# EAGLE schematic QT2640 (EAGLE 9.5.2)
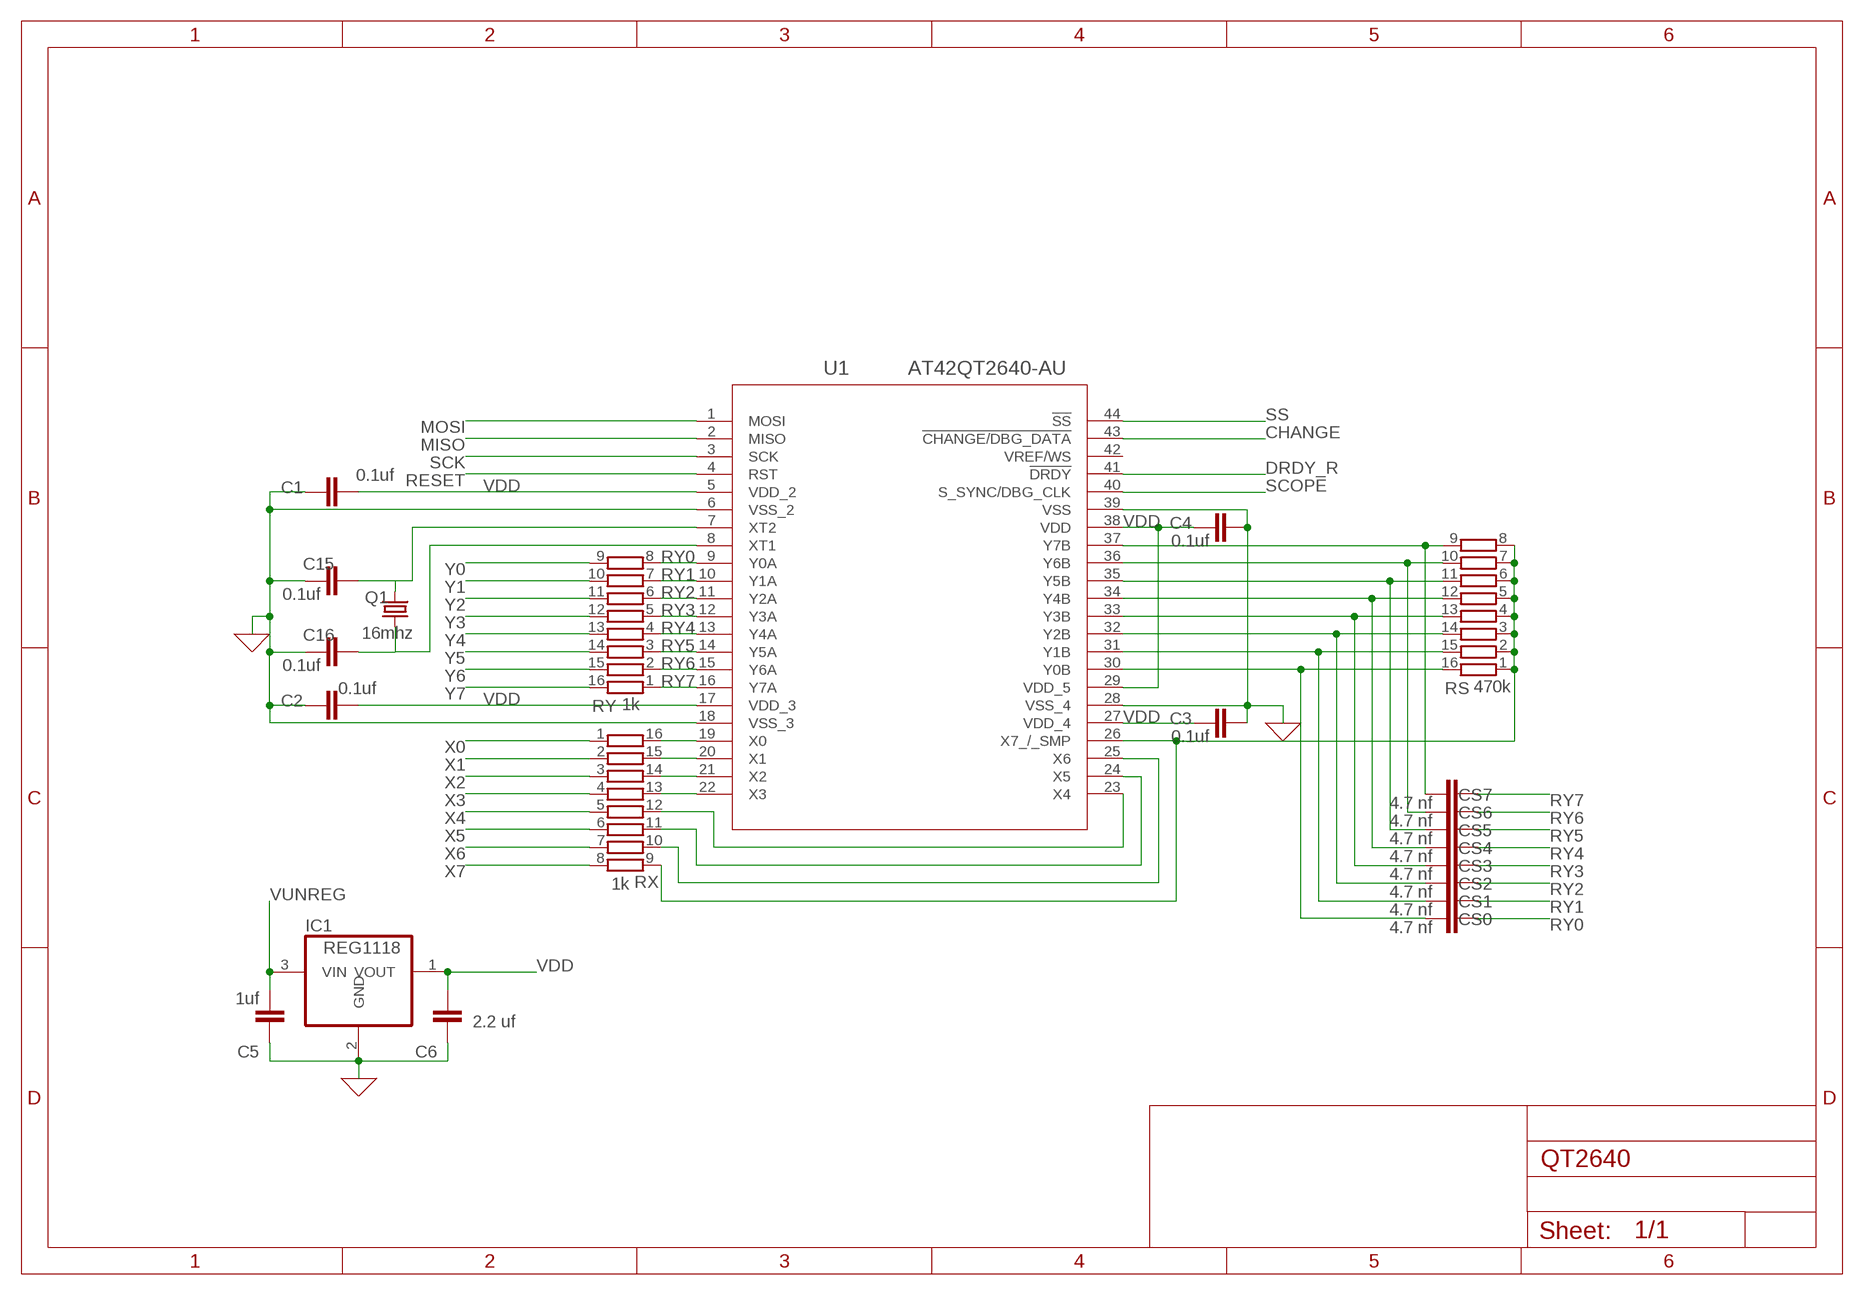
[diagram p0: schematic, sheet 1]

## Parts
C1  0.1uf  C2,5-3  [C2.5-3]
C2  0.1uf  C2,5-3  [C2.5-3]
C3  0.1uf  C2,5-3  [C2.5-3]
C4  0.1uf  C2,5-3  [C2.5-3]
C5  1uf  C2,5-3  [C2.5-3]
C6  2.2 uf  C2,5-3  [C2.5-3]
C15  0.1uf  C2,5-3  [C2.5-3]
C16  0.1uf  C2,5-3  [C2.5-3]
CS0  4.7 nf  C2,5-3  [C2.5-3]
CS1  4.7 nf  C2,5-3  [C2.5-3]
CS2  4.7 nf  C2,5-3  [C2.5-3]
CS3  4.7 nf  C2,5-3  [C2.5-3]
CS4  4.7 nf  C2,5-3  [C2.5-3]
CS5  4.7 nf  C2,5-3  [C2.5-3]
CS6  4.7 nf  C2,5-3  [C2.5-3]
CS7  4.7 nf  C2,5-3  [C2.5-3]
IC1  REG1118  [SOT223]
Q1  16mhz  CSM-7X-DU  [CSM-7X-DU]
RS  470k  4816P-T01  [4816P]
RX  1k  4816P-T01  [4816P]
RY  1k  4816P-T01  [4816P]
U1  AT42QT2640-AU  [TQFP44_10X10MC]

## Nets
0: C1.1 C2.1 C3.2 C4.2 C5.1 C6.1 C15.1 C16.1 IC1.2(GND) U1.6(VSS_2) U1.18(VSS_3) U1.28(VSS_4) U1.39(VSS) ; supply symbol labelled GND
CHANGE: U1.43(!CHANGE/DBG_DATA)
DRDY_R: U1.41(!DRDY)
MISO: U1.2(MISO)
MOSI: U1.1(MOSI)
N$1: RS.1 RS.2 RS.3 RS.4 RS.5 RS.6 RS.7 RS.8 RX.9 U1.26(X7_/_SMP)
N$3: CS0.1 RS.16 U1.30(Y0B)
N$4: CS1.1 RS.15 U1.31(Y1B)
N$5: CS2.1 RS.14 U1.32(Y2B)
N$6: CS3.1 RS.13 U1.33(Y3B)
N$7: CS4.1 RS.12 U1.34(Y4B)
N$8: CS5.1 RS.11 U1.35(Y5B)
N$9: RX.16 U1.19(X0)
N$10: CS6.1 RS.10 U1.36(Y6B)
N$11: RX.15 U1.20(X1)
N$12: RX.14 U1.21(X2)
N$13: RX.13 U1.22(X3)
N$14: RX.12 U1.23(X4)
N$15: RX.11 U1.24(X5)
N$16: RX.10 U1.25(X6)
N$23: CS7.1 RS.9 U1.37(Y7B)
RESET: U1.4(RST)
RY0: CS0.2 RY.8 U1.9(Y0A)
RY1: CS1.2 RY.7 U1.10(Y1A)
RY2: CS2.2 RY.6 U1.11(Y2A)
RY3: CS3.2 RY.5 U1.12(Y3A)
RY4: CS4.2 RY.4 U1.13(Y4A)
RY5: CS5.2 RY.3 U1.14(Y5A)
RY6: CS6.2 RY.2 U1.15(Y6A)
RY7: CS7.2 RY.1 U1.16(Y7A)
SCK: U1.3(SCK)
SCOPE: U1.40(S_SYNC/DBG_CLK)
SS: U1.44(!SS)
VDD: C1.2 C2.2 C3.1 C4.1 C6.2 IC1.1(VOUT) U1.5(VDD_2) U1.17(VDD_3) U1.27(VDD_4) U1.29(VDD_5) U1.38(VDD)
VUNREG: C5.2 IC1.3(VIN)
X0: RX.1
X1: RX.2
X2: RX.3
X3: RX.4
X4: RX.5
X5: RX.6
X6: RX.7
X7: RX.8
XT1: C16.2 Q1.1 U1.8(XT1)
XT2: C15.2 Q1.2 U1.7(XT2)
Y0: RY.9
Y1: RY.10
Y2: RY.11
Y3: RY.12
Y4: RY.13
Y5: RY.14
Y6: RY.15
Y7: RY.16

## Power pins joined to a net without a drawn wire
VREF/WS: U1.42(VREF/WS)

## Library data of the parts
C1-C6 C15 C16 CS0 CS1-CS7 = capacitor-wima:C: CAPACITOR naming: grid - package width
IC1 = burr-brown:REG1118: 800mA Low Dropout (LDO) Positive Regulator with Current Source and Sink Capability; MPN: REG1118-2.85/2K5G4; OC_FARNELL: unknown; OC_NEWARK: 14M2185
Q1 = crystal:CSM-7X-DU: SMD CRYSTAL Source: www.ecsxtal.com .. Crystal 3.6864MHz CSM_7X_DU.PDF; OC_FARNELL: unknown; OC_NEWARK: unknown
RS RX RY = resistor-bourns:4816P-T01: BOURNS RESISTOR NETWORK; MF: BOURNS, INC.; MPN: 4816P-T01-684LF; OC_FARNELL: 9357483; OC_NEWARK: 33K0707
U1 = capative touch:AT42QT2640-AU; BUILT_BY: EMA_Molly; COPYRIGHT: Copyright (C) 2018 Accelerated Designs. All rights reserved; MANUFACTURER_PART_NUMBER: AT42QT2640-AU; VENDOR: Microchip